# Altium schematic sheet ArmDebuger(3-7)STLink_V2.SchDoc
size 393 x 241 mm
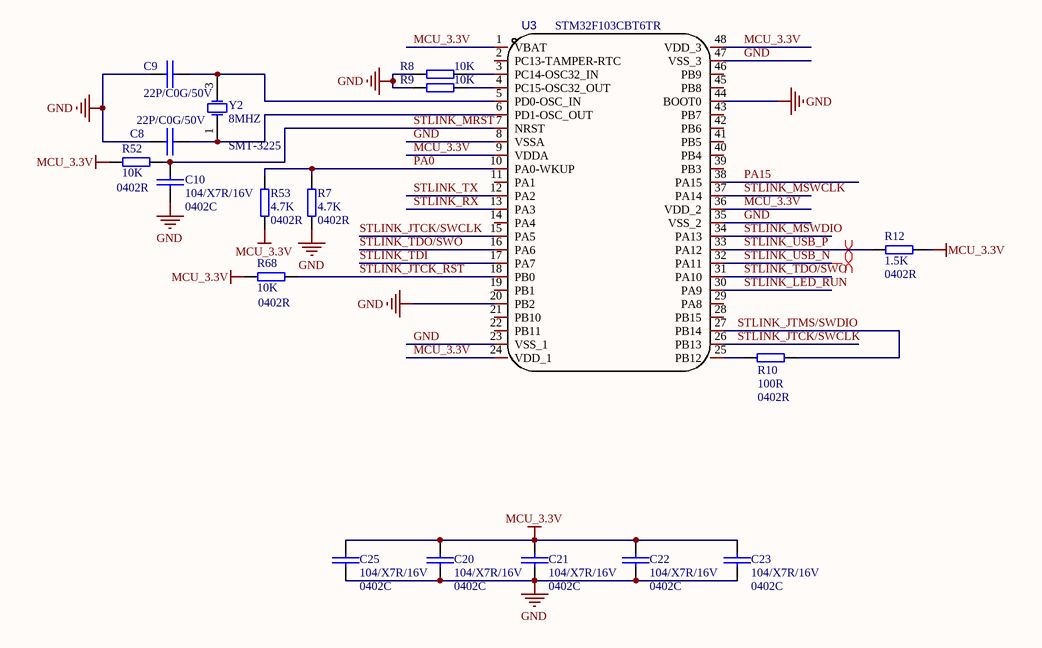
[diagram p0: ArmDebuger(3-7)STLink_V2.SchDoc]

## Parts
C8  22P/C0G/50V  [0402C-SMD-M]
C9  22P/C0G/50V  [0402C-SMD-M]
C10  104/X7R/16V  Fp: 0402C  [0402C-SMD-M]
C20  104/X7R/16V  Fp: 0402C  [0402C-SMD-M]
C21  104/X7R/16V  Fp: 0402C  [0402C-SMD-M]
C22  104/X7R/16V  Fp: 0402C  [0402C-SMD-M]
C23  104/X7R/16V  Fp: 0402C  [0402C-SMD-M]
C25  104/X7R/16V  Fp: 0402C  [0402C-SMD-M]
R7  4.7K  Fp: 0402R  [0402R-SMD-M]
R8  10K  [0402R-SMD-M]
R9  10K  [0402R-SMD-M]
R10  100R  Fp: 0402R  [0402R-SMD-M]
R12  1.5K  Fp: 0402R  [0402R-SMD-M]
R52  10K  Fp: 0402R  [0402R-SMD-M]
R53  4.7K  Fp: 0402R  [0402R-SMD-M]
R68  10K  Fp: 0402R  [0402R-SMD-M]
U3  STM32F103CBT6TR  [LQFP48_L]
Y2  8MHZ  Fp: SMT-3225  [CRYSTAL-SMT-3225]

## Nets
GND: C8.1 C9.1 C10.1 C20.1 C21.1 C22.1 C23.1 C25.1 R7.1 R8.1 R9.1 U3.8(VSSA) U3.20(PB2) U3.23(VSS_1) U3.35(VSS_2) U3.44(BOOT0) U3.47(VSS_3)
MCU_3.3V: C20.2 C21.2 C22.2 C23.2 C25.2 R12.1 R52.1 R53.1 R68.1 U3.1(VBAT) U3.9(VDDA) U3.24(VDD_1) U3.36(VDD_2) U3.48(VDD_3)
PA0: R7.2 R53.2 U3.10(PA0-WKUP)
PA15: U3.38(PA15)
STLINK_JTCK/SWCLK: U3.15(PA5) U3.26(PB13)
STLINK_JTCK_RST: R68.2 U3.18(PB0)
STLINK_JTMS/SWDIO: R10.2 U3.27(PB14)
STLINK_LED_RUN: U3.30(PA9)
STLINK_MRST: C10.2 R52.2 U3.7(NRST)
STLINK_MSWCLK: U3.37(PA14)
STLINK_MSWDIO: U3.34(PA13)
STLINK_RX: U3.13(PA3)
STLINK_TDI: U3.17(PA7)
STLINK_TDO/SWO: U3.16(PA6) U3.31(PA10)
STLINK_TX: U3.12(PA2)
STLINK_USB_N: U3.32(PA11)
STLINK_USB_P: R12.2 U3.33(PA12)
NetC8_2: C8.2 U3.6(PD1-OSC_OUT) Y2.1(OSC1)
NetC9_2: C9.2 U3.5(PD0-OSC_IN) Y2.3(OSC2)
NetR8_2: R8.2 U3.3(PC14-OSC32_IN)
NetR9_2: R9.2 U3.4(PC15-OSC32_OUT)
NetR10_1: R10.1 U3.25(PB12)

Not connected (* = marked no-connect by the designer): U3 2(PC13-TAMPER-RTC) 11(PA1) 14(PA4) 19(PB1) 21(PB10) 22(PB11) 28(PB15) 29(PA8) 39(PB3) 40(PB4) 41(PB5) 42(PB6) 43(PB7) 45(PB8) 46(PB9)

## Layout directives
differential pair: STLINK_USB_N, STLINK_USB_P

## Library data of the parts
C8 C9 = CAP: Fp: 0402C; P/N: 06076; LCSC: C167428
C10 C20-C23 C25 = CAP: P/N: 06075; LCSC: C60474
R7 R53 = RES: P/N: 04156; LCSC: C25900
R8 R9 = RES: Fp: 0402R; P/N: 04120; LCSC: C25744
R10 = RES: P/N: 04154; LCSC: C106232
R12 = RES: P/N: 04163; LCSC: C25867
R52 R68 = RES: P/N: 04120; LCSC: C25744
U3 = STM32F103C8T6TR: Fp: LQFP48; P/N: ?; taobao: https://m.tb.cn/h.5UjFpJ6?tk=nM8UWaFiXVg
Y2 = SMD-3225_4P  25MHZ 12PF 10PPM: 贴片晶振; LCSC: C5308002; P/N: ?